# EAGLE schematic E-inkV0.9 (EAGLE 6.3)
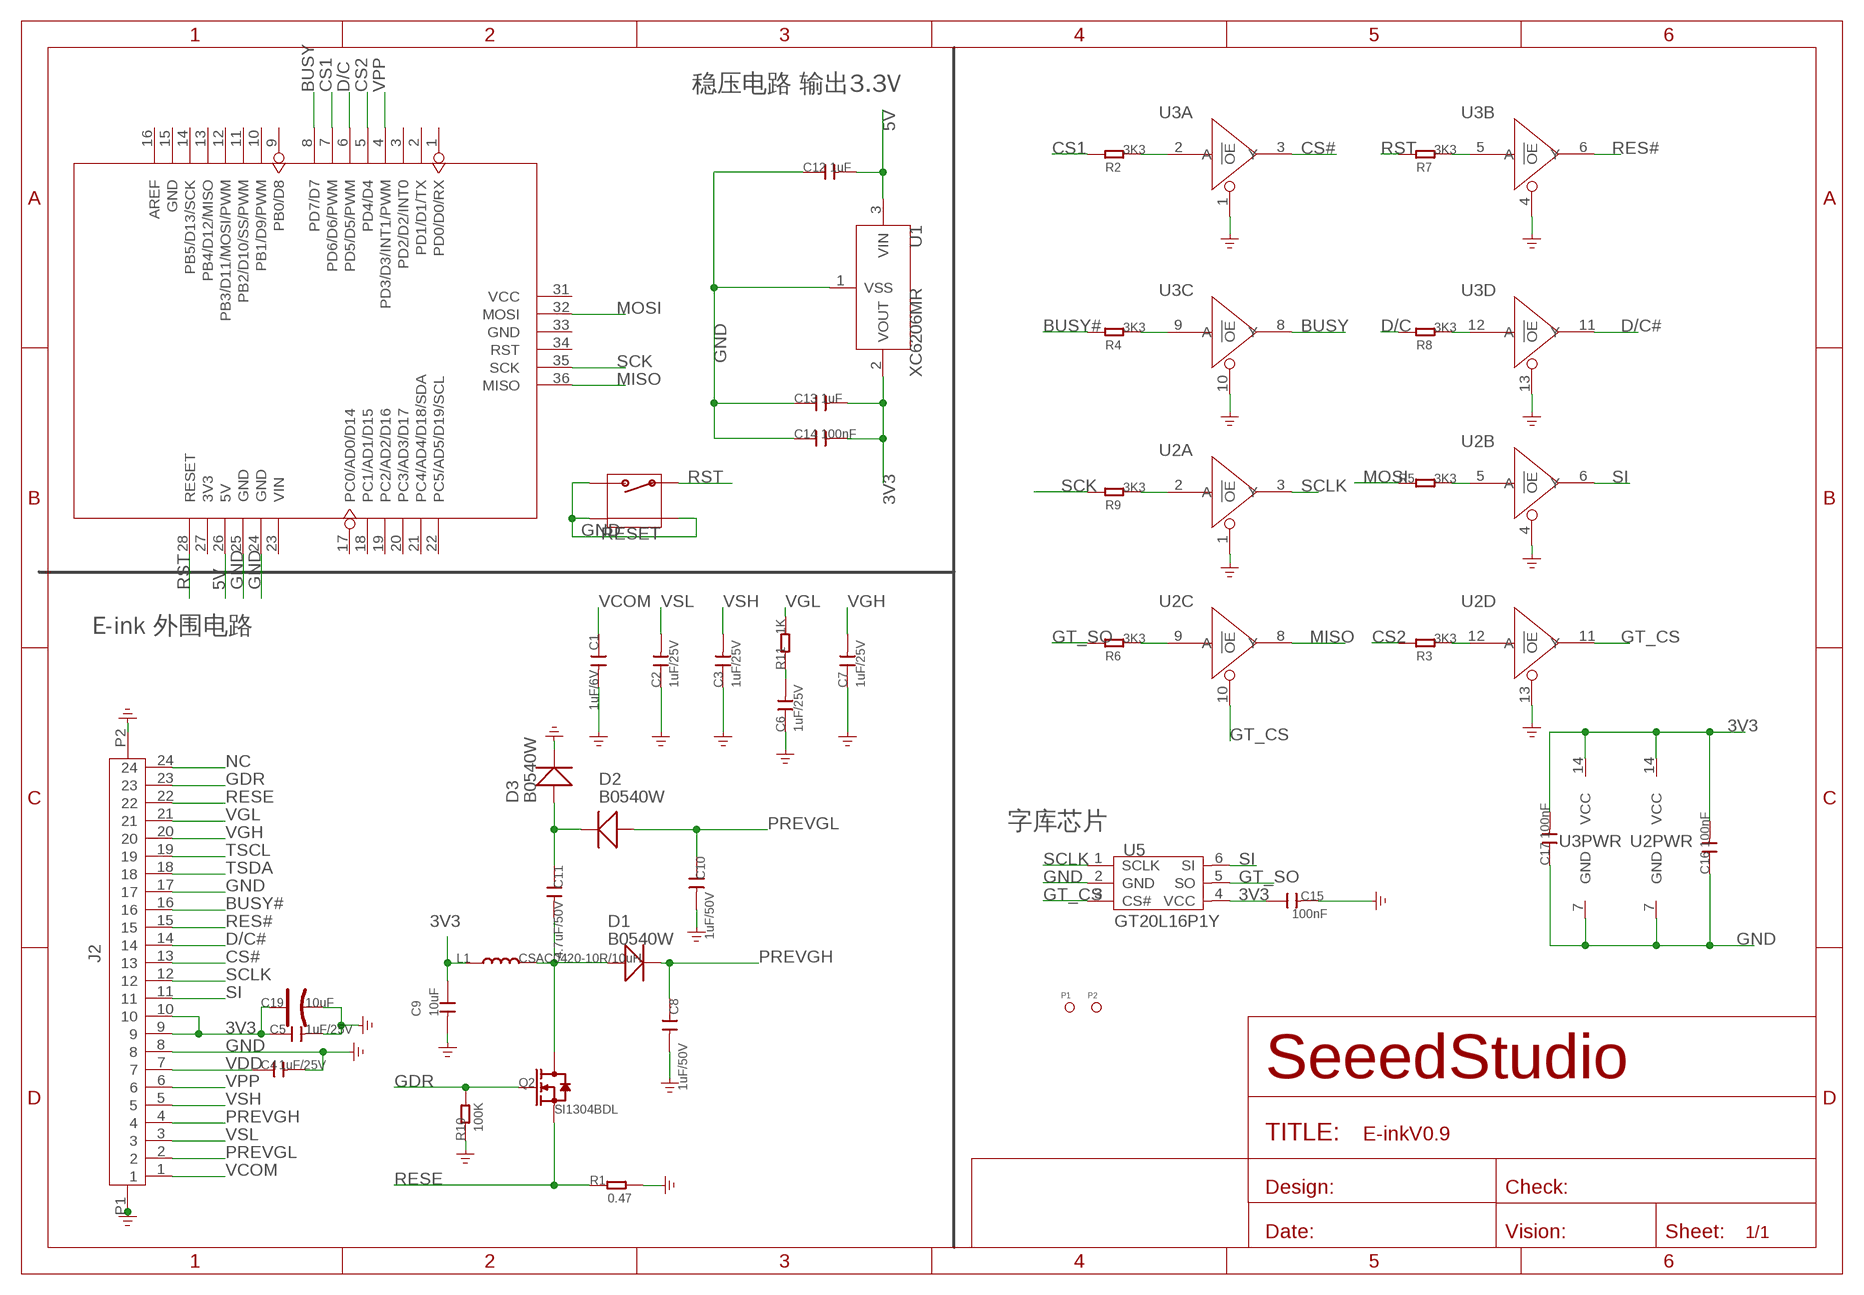
[diagram p0: schematic, sheet 1]

## Parts
C1  1uF/6V  C-0805  [C0805]
C2  1uF/25V  C-0805  [C0805]
C3  1uF/25V  C-0805  [C0805]
C4  1uF/25V  C-0805  [C0805]
C5  1uF/25V  C-0805  [C0805]
C6  1uF/25V  C-0805  [C0805]
C7  1uF/25V  C-0805  [C0805]
C8  1uF/50V  C-0805  [C0805]
C9  10uF  C-0805  [C0805]
C10  1uF/50V  C-0805  [C0805]
C11  4.7uF/50V  C-0805  [C0805]
C12  1uF  C-0805  [C0805]
C13  1uF  C-0805  [C0805]
C14  100nF  C-0603  [C0603]
C15  100nF  C-0603  [C0603]
C16  100nF  C-0603  [C0603]
C17  100nF  C-0603  [C0603]
C19  10uF  CAP-AVX-A  [AVX-A]
D1  B0540W  D'MBR0520LT1'  [SOD123-2.7X1.6]
D2  B0540W  D'MBR0520LT1'  [SOD123-2.7X1.6]
D3  B0540W  D'MBR0520LT1'  [SOD123-2.7X1.6]
J2  FPC_CONNECTOR  FPC-CONNECTOR-24P-0.5'ST-FPC-052024-B'  [24P-0.5]
L1  CSAC0420-10R/10uH  L'1616BZ'  [1616BZ]
P1  PAD-MARK  [ROUND-MARK-1.0]
P2  PAD-MARK  [ROUND-MARK-1.0]
Q2  SI1304BDL  MOSFET-N'SI1304BDL'  [SOT323]
R1  0.47  R-0603  [R0603]
R2  3K3  R-0603  [R0603]
R3  3K3  R-0603  [R0603]
R4  3K3  R-0603  [R0603]
R5  3K3  R-0603  [R0603]
R6  3K3  R-0603  [R0603]
R7  3K3  R-0603  [R0603]
R8  3K3  R-0603  [R0603]
R9  3K3  R-0603  [R0603]
R10  100K  R-0603  [R0603]
R11  1K  R-0603  [R0603]
RESET  FOR_TEST_ALBERT_V6_BUTTON_4P_SMD  [FOR_TEST_ALBERT_V6_4P-SMD-7X3.5X3.5]
U1  XC6206MR  [SOT23]
U2  74VHC125PW  [TSSOP14]
U3  74VHC125PW  [TSSOP14]
U4  ARDUINO  [ARDUINO-ISP-SMD]
U5  GT20L16P1Y  [SOT23-6]

## Nets
3V3: C5.1 C9.1 C13.2 C14.2 C15.1 C16.2 C17.2 C19.+ J2.9 J2.10 L1.1 U1.2(VOUT) U2.14(PWR:VCC) U3.14(PWR:VCC) U5.4(VCC)
5V: C12.2 U1.3(VIN) U4.26(5V)
BUSY: U3.8(C:Y) U4.8(PD7/D7)
BUSY#: J2.16 R4.1
CS1: R2.1 U4.7(PD6/D6/PWM)
CS2: R3.1 U4.5(PD4/D4)
CS#: J2.13 U3.3(A:Y)
D/C: R8.1 U4.6(PD5/D5/PWM)
D/C#: J2.14 U3.11(D:Y)
GDR: J2.23 Q2.1(G) R10.2
GND: C1.2 C2.1 C3.1 C4.2 C5.2 C6.1 C7.1 C8.2 C9.2 C10.2 C12.1 C13.1 C14.1 C15.2 C16.1 C17.1 C19.- D3.2(-) J2.8 J2.17 J2.P1 J2.P2 R1.2 R10.1 RESET.2 RESET.S1 RESET.S2 U1.1(VSS) U2.1(A:!OE) U2.4(B:!OE) U2.7(PWR:GND) U2.13(D:!OE) U3.1(A:!OE) U3.4(B:!OE) U3.7(PWR:GND) U3.10(C:!OE) U3.13(D:!OE) U4.24(GND) U4.25(GND) U5.2(GND)
GT_CS: U2.10(C:!OE) U2.11(D:Y) U5.3(CS#)
GT_SO: R6.1 U5.5(SO)
MISO: U2.8(C:Y) U4.36(MISO)
MOSI: R5.1 U4.32(MOSI)
N$1: C11.1 D2.2(-) D3.1(+)
N$2: C11.2 D1.1(+) L1.2 Q2.3(D)
N$3: R6.2 U2.9(C:A)
N$4: R9.2 U2.2(A:A)
N$5: R4.2 U3.9(C:A)
N$6: R2.2 U3.2(A:A)
N$7: R7.2 U3.5(B:A)
N$8: R3.2 U2.12(D:A)
N$9: R5.2 U2.5(B:A)
N$10: R8.2 U3.12(D:A)
N$12: C6.2 R11.1
NC: J2.24
PREVGH: C8.1 D1.2(-) J2.4
PREVGL: C10.1 D2.1(+) J2.2
RES#: J2.15 U3.6(B:Y)
RESE: J2.22 Q2.2(S) R1.1
RST: R7.1 RESET.1 U4.28(RESET)
SCK: R9.1 U4.35(SCK)
SCLK: J2.12 U2.3(A:Y) U5.1(SCLK)
SI: J2.11 U2.6(B:Y) U5.6(SI)
TSCL: J2.19
TSDA: J2.18
VCOM: C1.1 J2.1
VDD: C4.1 J2.7
VGH: C7.2 J2.20
VGL: J2.21 R11.2
VPP: J2.6 U4.4(PD3/D3/INT1/PWM)
VSH: C3.2 J2.5
VSL: C2.2 J2.3
Unconnected: U4.1(PD0/D0/RX) U4.2(PD1/D1/TX) U4.3(PD2/D2/INT0) U4.9(PB0/D8) U4.10(PB1/D9/PWM) U4.11(PB2/D10/SS/PWM) U4.12(PB3/D11/MOSI/PWM) U4.13(PB4/D12/MISO) U4.14(PB5/D13/SCK) U4.15(GND) U4.16(AREF) U4.17(PC0/AD0/D14) U4.18(PC1/AD1/D15) U4.19(PC2/AD2/D16) U4.20(PC3/AD3/D17) U4.21(PC4/AD4/D18/SDA) U4.22(PC5/AD5/D19/SCL) U4.23(VIN) U4.27(3V3) U4.31(VCC) U4.33(GND) U4.34(RST)

## Notes on the sheet
- 稳压电路 输出3.3V
- E-ink 外围电路
- 字库芯片

## Library data of the parts
C1-C17 = Discrete:C*: Ceramic Capacitors
C19 = Discrete:CAP*: Electrolytic Capacitors,Tantalum Capacitors and Super Capacitors
D1-D3 = Discrete:D*
J2 = template:FPC-CONNECTOR-24P-0.5
L1 = Discrete:L*
P1 P2 = Discrete:PAD-MARK; PARTNO: DNP
Q2 = template:MOSFET-N*: IRLL014: http://www.vishay.com/docs/91319/sihll014.pdf
R1-R11 = Discrete:R*
RESET = TFT_Touch:FOR_TEST_ALBERT_V6_BUTTON_4P_SMD: TS-1188E http://www.best-dz.com/?thread-374-2.html
U1 = IC:XC6206: LOW ESR Cap.Compatible Positive Voltage Regulators
U2 U3 = template:74V*125: Quad Buffer/Line Driver;3-state
U4 = moudle:ARDUINO
U5 = template:GT20L16P1Y